# EAGLE design snare_host_brd (EAGLE 9.6.2)
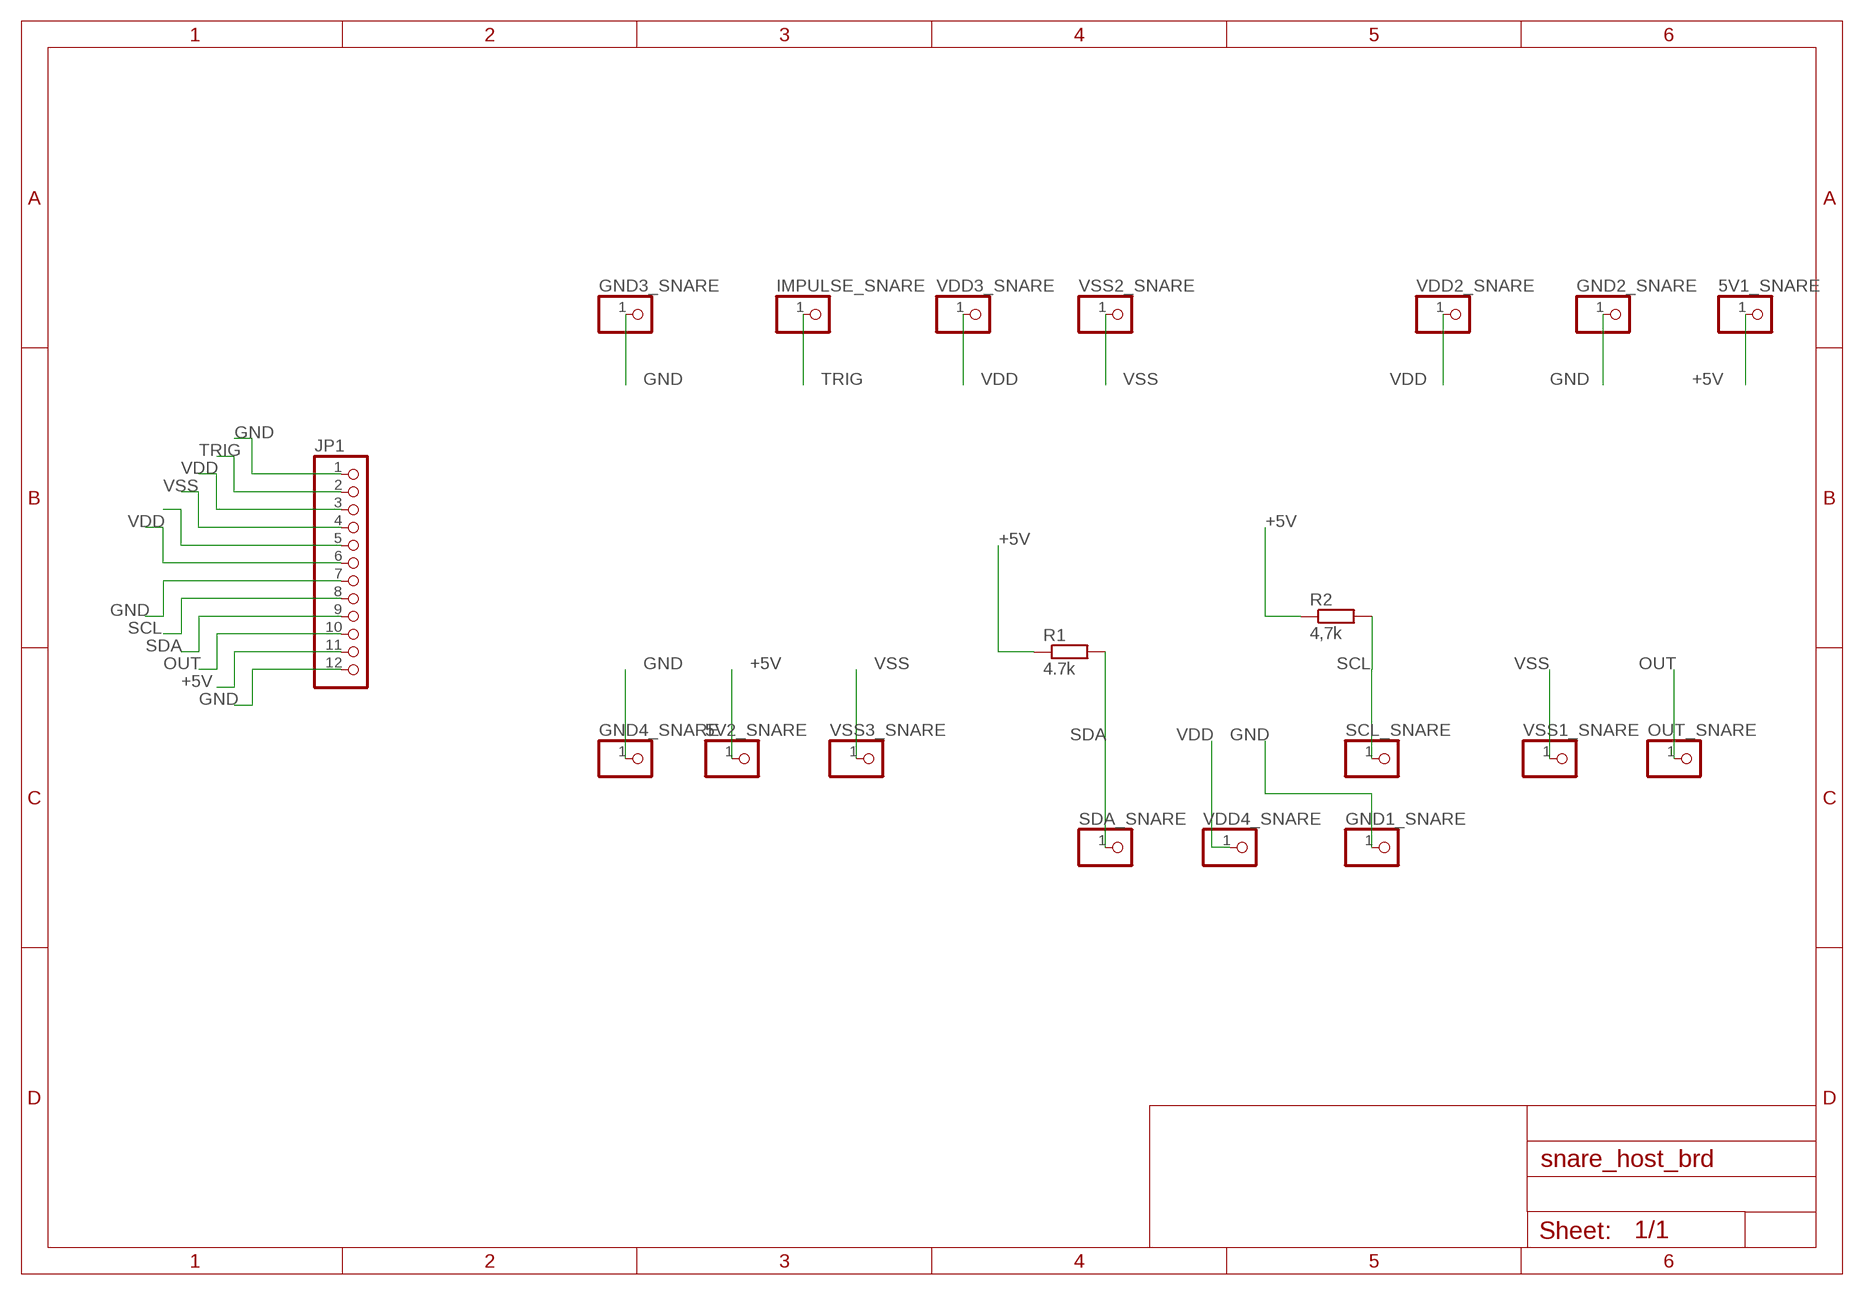
[diagram p0: schematic, sheet 1]

## Parts
5V1_SNARE  PINHD-1X1  [1X01]
5V2_SNARE  PINHD-1X1  [1X01]
GND1_SNARE  PINHD-1X1  [1X01]
GND2_SNARE  PINHD-1X1  [1X01]
GND3_SNARE  PINHD-1X1  [1X01]
GND4_SNARE  PINHD-1X1  [1X01]
IMPULSE_SNARE  PINHD-1X1  [1X01]
JP1  PINHD-1X12/90  [1X12/90]
OUT_SNARE  PINHD-1X1  [1X01]
R1  4.7k  R-EU_0207/10  [0207/10]
R2  4,7k  R-EU_0207/10  [0207/10]
SCL_SNARE  PINHD-1X1  [1X01]
SDA_SNARE  PINHD-1X1  [1X01]
VDD2_SNARE  PINHD-1X1  [1X01]
VDD3_SNARE  PINHD-1X1  [1X01]
VDD4_SNARE  PINHD-1X1  [1X01]
VSS1_SNARE  PINHD-1X1  [1X01]
VSS2_SNARE  PINHD-1X1  [1X01]
VSS3_SNARE  PINHD-1X1  [1X01]

## Nets
+5V: 5V1_SNARE.1 5V2_SNARE.1 JP1.11 R1.1 R2.1
GND: GND1_SNARE.1 GND2_SNARE.1 GND3_SNARE.1 GND4_SNARE.1 JP1.1 JP1.7 JP1.12
N$5: JP1.5
OUT: JP1.10 OUT_SNARE.1
SCL: JP1.8 R2.2 SCL_SNARE.1
SDA: JP1.9 R1.2 SDA_SNARE.1
TRIG: IMPULSE_SNARE.1 JP1.2
VDD: JP1.3 JP1.6 VDD2_SNARE.1 VDD3_SNARE.1 VDD4_SNARE.1
VSS: JP1.4 VSS1_SNARE.1 VSS2_SNARE.1 VSS3_SNARE.1

## Library data of the parts
5V1_SNARE 5V2_SNARE GND1_SNARE GND2_SNARE GND3_SNARE GND4_SNARE IMPULSE_SNARE OUT_SNARE SCL_SNARE SDA_SNARE VDD2_SNARE VDD3_SNARE VDD4_SNARE VSS1_SNARE VSS2_SNARE VSS3_SNARE = pinhead:PINHD-1X1: PIN HEADER
JP1 = pinhead:PINHD-1X12: PIN HEADER
R1 R2 = rcl:R-EU_: RESISTOR, European symbol; SPICEPREFIX: R

## Board
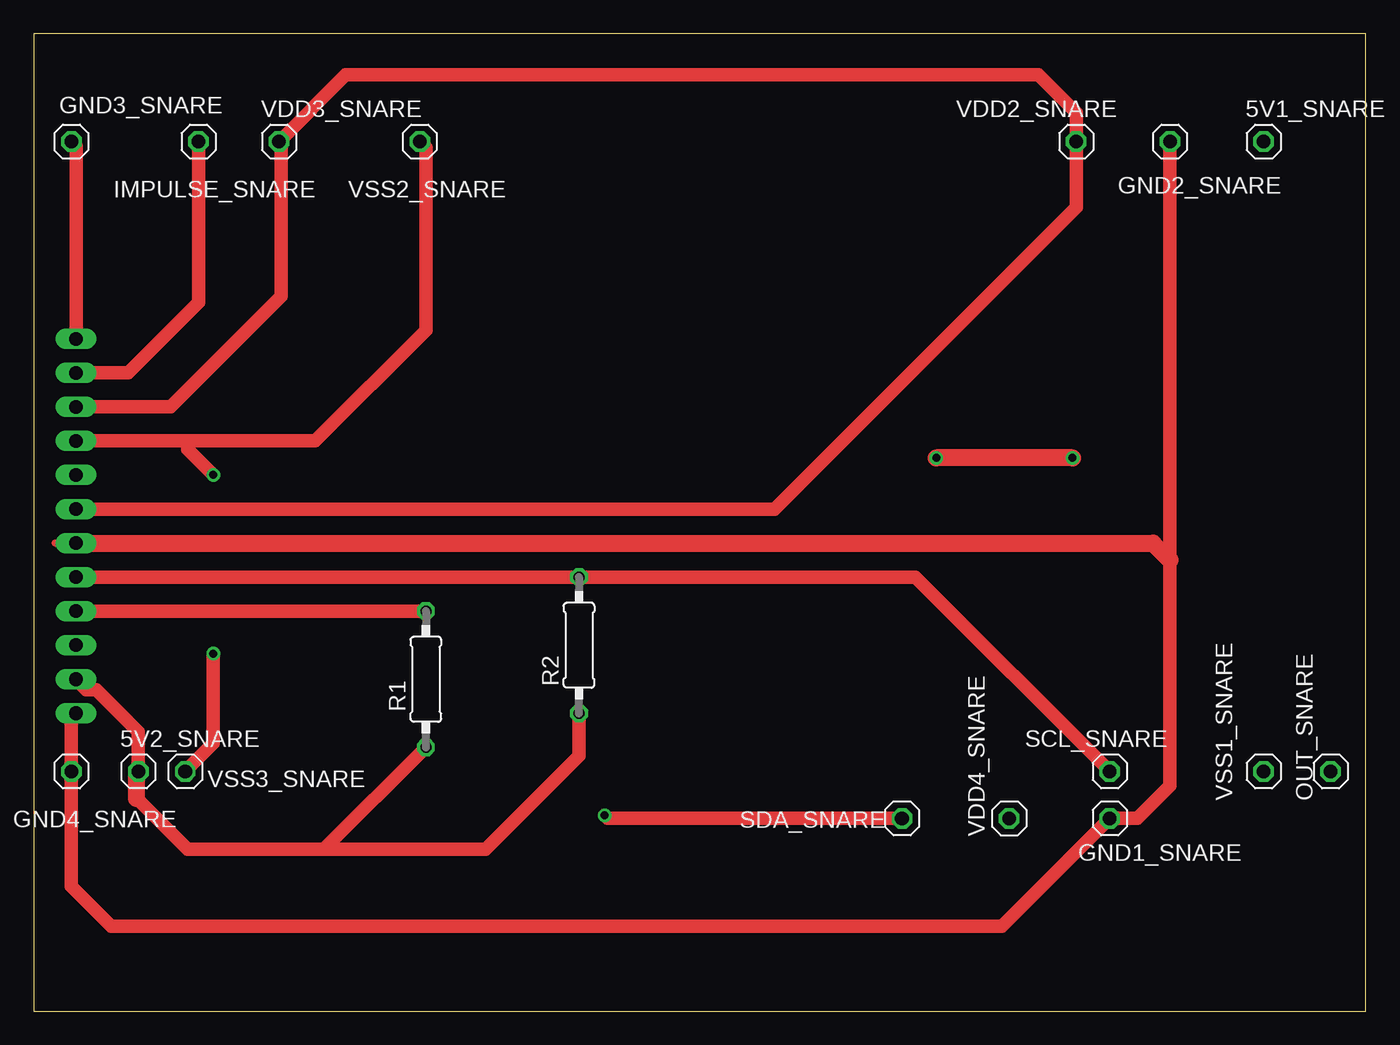
[diagram p1: board, top side]
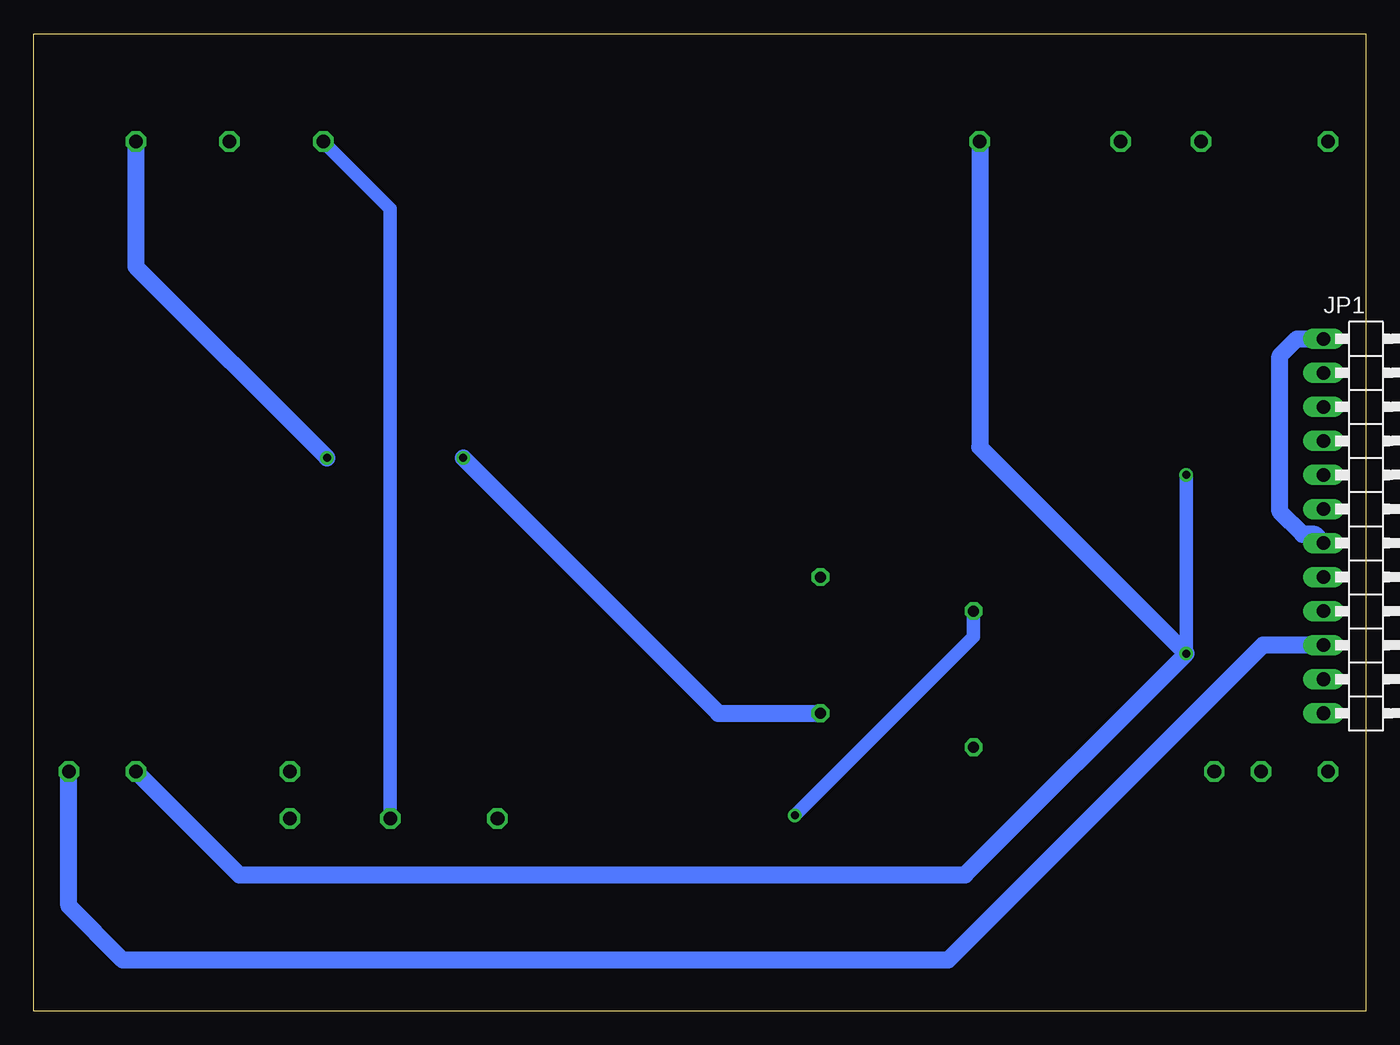
[diagram p2: board, bottom side, seen from below]

Size 99.46 x 72.95 mm. Coordinates in mm from the lower left corner, seen from the top.
Outline: 0,0 99.46,0 99.46,72.95 0,72.95 0,0
Copper layers (1*16): Top 0.035mm / dielectric 1.5mm / Bottom 0.035mm
Design rules "OpenLab": minimum track width 0.4mm, minimum drill 0.6mm, track to track 0.5mm, track to pad 0.5mm, pad to pad 0.5mm, via to via 0.5mm, smd to smd 0.1mm, copper to edge 2mm, drill to drill 0.2mm, minimum pad ring 10mil, minimum via ring 8mil, stop-mask expansion 4mil, vias tented up to drill 0mil, thermal gap 10mil

### Footprints (pad centres in the part's own frame; a part is rotated, then mirrored left to right if it is on the bottom)
1X01 = drill 1.016 octagon: 1 0,0
1X12/90 = drill 1.016 long: 1 -13.97,-3.81; 2 -11.43,-3.81; 3 -8.89,-3.81; 4 -6.35,-3.81; 5 -3.81,-3.81; 6 -1.27,-3.81; 7 1.27,-3.81; 8 3.81,-3.81; 9 6.35,-3.81; 10 8.89,-3.81; 11 11.43,-3.81; 12 13.97,-3.81
0207/10 = drill 0.813 octagon: 1 -5.08,0; 2 5.08,0

### Placement (x,y rotation side)
5V1_SNARE  91.83,64.89 0 top
5V2_SNARE  7.82,17.89 0 top
GND1_SNARE  80.33,14.39 0 top
GND2_SNARE  84.83,64.89 0 top
GND3_SNARE  2.82,64.89 0 top
GND4_SNARE  2.82,17.89 0 top
IMPULSE_SNARE  12.32,64.89 0 top
JP1  -0.64,36.2 270 bottom
OUT_SNARE  96.83,17.89 0 top
R1  29.29,24.77 90 top
R2  40.72,27.31 90 top
SCL_SNARE  80.33,17.89 0 top
SDA_SNARE  64.83,14.39 0 top
VDD2_SNARE  77.83,64.89 0 top
VDD3_SNARE  18.32,64.89 0 top
VDD4_SNARE  72.83,14.39 90 top
VSS1_SNARE  91.83,17.89 0 top
VSS2_SNARE  28.82,64.89 0 top
VSS3_SNARE  11.32,17.89 0 top

### Tracks (layer width: path | path; a pad name or v marks a point on that pad's centre or on a via)
+5V  (via drill 0.6)
  Top 1.016: JP1.11 3.94,24 4.67,24 7.82,20.84 5V2_SNARE.1 | R1.1 21.67,12.07 | 21.67,12.07 11.51,12.07 7.7,15.88 | 21.67,12.07 33.73,12.07 40.72,19.05 R2.1
  Top 1.27: v77.55,41.28 v67.39,41.28 | 7.7,15.88 7.7,17.76 5V2_SNARE.1
  Bottom 1.27: 5V1_SNARE.1 91.83,55.55 v77.55,41.28 | v67.39,41.28 48.34,22.23 R2.1
GND
  Top 0.508: 1.62,34.93 JP1.7
  Top 1.016: JP1.1 3.17,64.54 GND3_SNARE.1 | JP1.12 2.82,21.88 GND4_SNARE.1 2.82,9.32 5.79,6.35 72.29,6.35 GND1_SNARE.1 82.41,14.39 84.83,16.8 84.83,33.66 GND2_SNARE.1
  Top 1.27: JP1.7 83.56,34.93 84.83,33.66
  Bottom 1.27: JP1.7 3.82,35.57 4.72,35.57 6.43,37.28 6.43,48.9 5.16,50.17 JP1.1
OUT
  Bottom 1.27: JP1.10 7.7,27.31 31.19,3.81 92.79,3.81 96.83,7.85 OUT_SNARE.1
SCL
  Top 1.016: JP1.8 R2.2 65.83,32.39 SCL_SNARE.1
SDA  (via drill 0.6)
  Top 1.016: JP1.9 R1.2 | SDA_SNARE.1 42.84,14.39 v42.62,14.61
  Bottom 1.016: v42.62,14.61 29.29,27.94 R1.2
TRIG
  Top 1.016: JP1.2 7.06,47.62 12.32,52.89 IMPULSE_SNARE.1
VDD
  Top 1.016: JP1.3 10.24,45.09 18.5,53.34 18.5,64.72 VDD3_SNARE.1 23.29,69.85 75.01,69.85 77.83,67.04 VDD2_SNARE.1 77.83,59.97 55.33,37.47 JP1.6
  Bottom 1.016: VDD4_SNARE.1 72.83,59.89 VDD2_SNARE.1
VSS  (via drill 0.6)
  Top 1.016: JP1.4 11.51,42.55 | 11.51,42.55 21.04,42.55 29.29,50.8 29.29,64.42 VSS2_SNARE.1 | VSS3_SNARE.1 13.41,19.98 v13.41,26.67 | v13.41,40.01 11.51,41.91 11.51,42.55
  Bottom 1.016: v13.41,40.01 v13.41,26.67
  Bottom 1.27: VSS2_SNARE.1 28.82,42.08 v13.41,26.67 29.93,10.16 84.1,10.16 VSS1_SNARE.1